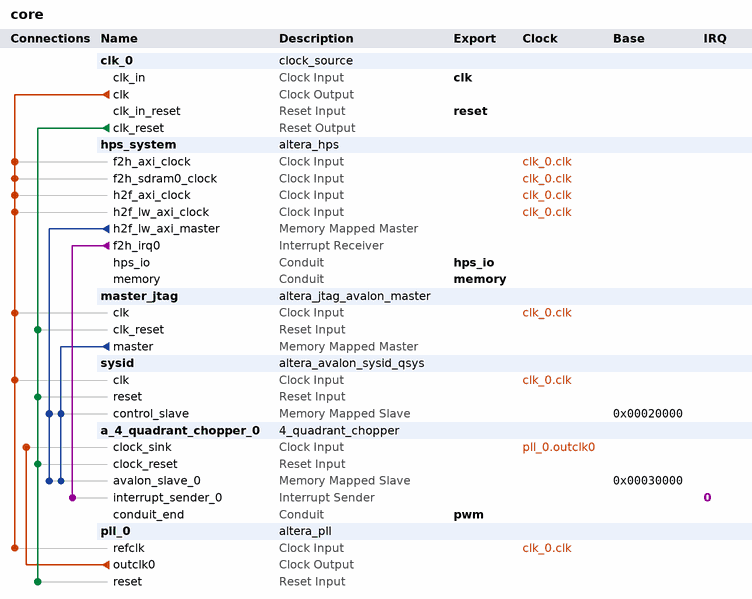
[diagram p0: system contents]
# Platform Designer (Qsys) system core, Cyclone V 5CSXFC6D6F31C6
# Parameters at their usual value, and those the tool derives, are not listed.
package require -exact qsys 18.1
create_system core
set_project_property DEVICE_FAMILY {Cyclone V}
set_project_property DEVICE 5CSXFC6D6F31C6

add_instance clk_0 clock_source 18.1
set_instance_parameter_value clk_0 clockFrequency 50000000

add_instance hps_system altera_hps 18.1
set_instance_parameter_value hps_system EMAC1_Mode RGMII
set_instance_parameter_value hps_system EMAC1_PinMuxing {HPS I/O Set 0}
set_instance_parameter_value hps_system F2SCLK_COLDRST_Enable false
set_instance_parameter_value hps_system F2SCLK_DBGRST_Enable false
set_instance_parameter_value hps_system F2SCLK_WARMRST_Enable false
set_instance_parameter_value hps_system F2SDRAM_Type AXI-3
set_instance_parameter_value hps_system F2SDRAM_Width 64
set_instance_parameter_value hps_system F2SINTERRUPT_Enable true
set_instance_parameter_value hps_system F2S_Width 2
set_instance_parameter_value hps_system FPGA_PERIPHERAL_OUTPUT_CLOCK_FREQ_EMAC0_GTX_CLK 125
set_instance_parameter_value hps_system FPGA_PERIPHERAL_OUTPUT_CLOCK_FREQ_EMAC0_MD_CLK 2.5
set_instance_parameter_value hps_system FPGA_PERIPHERAL_OUTPUT_CLOCK_FREQ_EMAC1_GTX_CLK 125
set_instance_parameter_value hps_system FPGA_PERIPHERAL_OUTPUT_CLOCK_FREQ_EMAC1_MD_CLK 2.5
set_instance_parameter_value hps_system HPS_PROTOCOL DDR3
set_instance_parameter_value hps_system I2C0_Mode I2C
set_instance_parameter_value hps_system I2C0_PinMuxing {HPS I/O Set 0}
set_instance_parameter_value hps_system I2C1_Mode I2C
set_instance_parameter_value hps_system I2C1_PinMuxing {HPS I/O Set 0}
set_instance_parameter_value hps_system LWH2F_Enable true
set_instance_parameter_value hps_system MEM_BANKADDR_WIDTH 3
set_instance_parameter_value hps_system MEM_CLK_FREQ 400.0
set_instance_parameter_value hps_system MEM_COL_ADDR_WIDTH 10
set_instance_parameter_value hps_system MEM_DQ_WIDTH 32
set_instance_parameter_value hps_system MEM_DRV_STR RZQ/7
set_instance_parameter_value hps_system MEM_ROW_ADDR_WIDTH 15
set_instance_parameter_value hps_system MEM_RTT_NOM RZQ/4
set_instance_parameter_value hps_system MEM_RTT_WR RZQ/4
set_instance_parameter_value hps_system MEM_TCL 11
set_instance_parameter_value hps_system MEM_TFAW_NS 30.0
set_instance_parameter_value hps_system MEM_TRAS_NS 35.0
set_instance_parameter_value hps_system MEM_TRCD_NS 13.75
set_instance_parameter_value hps_system MEM_TRFC_NS 260.0
set_instance_parameter_value hps_system MEM_TRP_NS 13.75
set_instance_parameter_value hps_system MEM_VENDOR Micron
set_instance_parameter_value hps_system MEM_WTCL 8
set_instance_parameter_value hps_system MPU_EVENTS_Enable true
set_instance_parameter_value hps_system QSPI_Mode N/A
set_instance_parameter_value hps_system QSPI_PinMuxing Unused
set_instance_parameter_value hps_system REF_CLK_FREQ 25.0
set_instance_parameter_value hps_system S2FCLK_USER2CLK 5
set_instance_parameter_value hps_system S2F_Width 2
set_instance_parameter_value hps_system SDIO_Mode {4-bit Data}
set_instance_parameter_value hps_system SDIO_PinMuxing {HPS I/O Set 0}
set_instance_parameter_value hps_system SPIM1_Mode N/A
set_instance_parameter_value hps_system SPIM1_PinMuxing Unused
set_instance_parameter_value hps_system STM_Enable false
set_instance_parameter_value hps_system TIMING_BOARD_AC_SKEW 0.02
set_instance_parameter_value hps_system TIMING_BOARD_AC_TO_CK_SKEW 0.01
set_instance_parameter_value hps_system TIMING_BOARD_DQ_TO_DQS_SKEW 0.05
set_instance_parameter_value hps_system TIMING_BOARD_MAX_CK_DELAY 0.03
set_instance_parameter_value hps_system TIMING_BOARD_MAX_DQS_DELAY 0.02
set_instance_parameter_value hps_system TIMING_BOARD_SKEW_BETWEEN_DQS 0.06
set_instance_parameter_value hps_system TIMING_BOARD_SKEW_CKDQS_DIMM_MAX 0.12
set_instance_parameter_value hps_system TIMING_BOARD_SKEW_CKDQS_DIMM_MIN 0.06
set_instance_parameter_value hps_system TIMING_BOARD_SKEW_WITHIN_DQS 0.01
set_instance_parameter_value hps_system TIMING_TDH 65
set_instance_parameter_value hps_system TIMING_TDQSCK 255
set_instance_parameter_value hps_system TIMING_TDQSQ 125
set_instance_parameter_value hps_system TIMING_TDS 30
set_instance_parameter_value hps_system TIMING_TIH 140
set_instance_parameter_value hps_system TIMING_TIS 180
set_instance_parameter_value hps_system TIMING_TQSH 0.4
set_instance_parameter_value hps_system UART0_Mode {No Flow Control}
set_instance_parameter_value hps_system UART0_PinMuxing {HPS I/O Set 0}
set_instance_parameter_value hps_system USB1_Mode N/A
set_instance_parameter_value hps_system USB1_PinMuxing Unused
set_instance_parameter_value hps_system desired_cfg_clk_mhz 100.0
set_instance_parameter_value hps_system desired_qspi_clk_mhz 400.0

add_instance master_jtag altera_jtag_avalon_master 18.1

add_instance sysid altera_avalon_sysid_qsys 18.1
set_instance_parameter_value sysid id -1412567125

add_instance a_4_quadrant_chopper_0 4_quadrant_chopper 1.0

add_instance pll_0 altera_pll 18.1
set_instance_parameter_value pll_0 gui_device_speed_grade 1
set_instance_parameter_value pll_0 gui_number_of_clocks 1
set_instance_parameter_value pll_0 gui_operation_mode direct
set_instance_parameter_value pll_0 gui_output_clock_frequency0 100.0
set_instance_parameter_value pll_0 gui_pll_mode {Integer-N PLL}
set_instance_parameter_value pll_0 gui_reference_clock_frequency 50.0
set_instance_parameter_value pll_0 gui_use_locked false

# connections
add_connection clk_0.clk hps_system.f2h_axi_clock clock
add_connection clk_0.clk hps_system.f2h_sdram0_clock clock
add_connection clk_0.clk hps_system.h2f_axi_clock clock
add_connection clk_0.clk hps_system.h2f_lw_axi_clock clock
add_connection clk_0.clk master_jtag.clk clock
add_connection clk_0.clk pll_0.refclk clock
add_connection clk_0.clk sysid.clk clock
add_connection pll_0.outclk0 a_4_quadrant_chopper_0.clock_sink clock
add_connection clk_0.clk_reset a_4_quadrant_chopper_0.clock_reset reset
add_connection clk_0.clk_reset master_jtag.clk_reset reset
add_connection clk_0.clk_reset pll_0.reset reset
add_connection clk_0.clk_reset sysid.reset reset
add_connection hps_system.h2f_lw_axi_master a_4_quadrant_chopper_0.avalon_slave_0 avalon
set_connection_parameter_value hps_system.h2f_lw_axi_master/a_4_quadrant_chopper_0.avalon_slave_0 baseAddress 0x00030000
add_connection hps_system.h2f_lw_axi_master sysid.control_slave avalon
set_connection_parameter_value hps_system.h2f_lw_axi_master/sysid.control_slave baseAddress 0x00020000
add_connection master_jtag.master a_4_quadrant_chopper_0.avalon_slave_0 avalon
set_connection_parameter_value master_jtag.master/a_4_quadrant_chopper_0.avalon_slave_0 baseAddress 0x00030000
add_connection master_jtag.master sysid.control_slave avalon
set_connection_parameter_value master_jtag.master/sysid.control_slave baseAddress 0x00020000
add_connection hps_system.f2h_irq0 a_4_quadrant_chopper_0.interrupt_sender_0 interrupt
set_connection_parameter_value hps_system.f2h_irq0/a_4_quadrant_chopper_0.interrupt_sender_0 irqNumber 0

# exported interfaces
add_interface clk clock sink
set_interface_property clk EXPORT_OF clk_0.clk_in
add_interface hps_io conduit end
set_interface_property hps_io EXPORT_OF hps_system.hps_io
add_interface memory conduit end
set_interface_property memory EXPORT_OF hps_system.memory
add_interface pwm conduit end
set_interface_property pwm EXPORT_OF a_4_quadrant_chopper_0.conduit_end
add_interface reset reset sink
set_interface_property reset EXPORT_OF clk_0.clk_in_reset

set_interconnect_requirement {$system} qsys_mm.clockCrossingAdapter HANDSHAKE
set_interconnect_requirement {$system} qsys_mm.enableEccProtection FALSE
set_interconnect_requirement {$system} qsys_mm.insertDefaultSlave FALSE
set_interconnect_requirement {$system} qsys_mm.maxAdditionalLatency 1

save_system core.qsys
